# Altium schematic sheet CAM_LCD_TV.SchDoc
size 558 x 431 mm
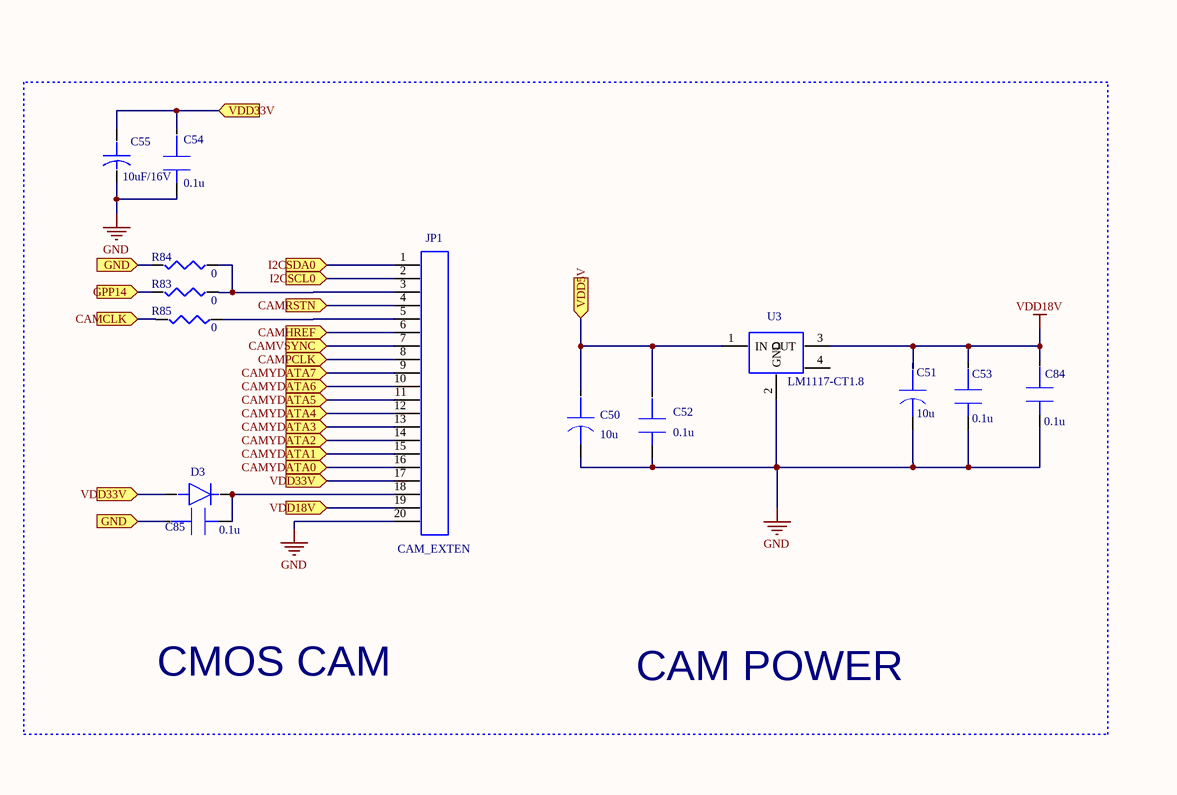
[diagram p0: CAM_LCD_TV.SchDoc, top left]
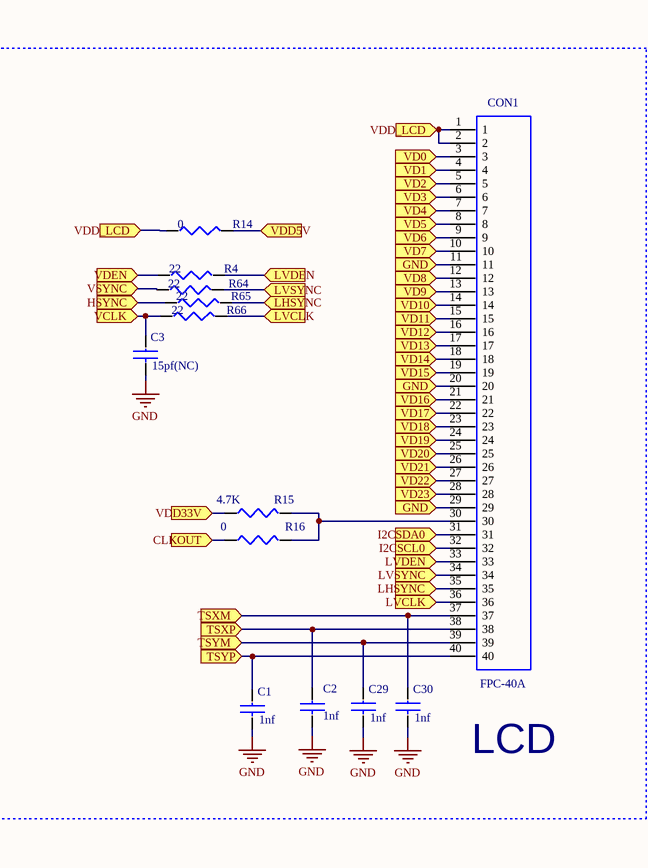
[diagram p1: CAM_LCD_TV.SchDoc, top right]
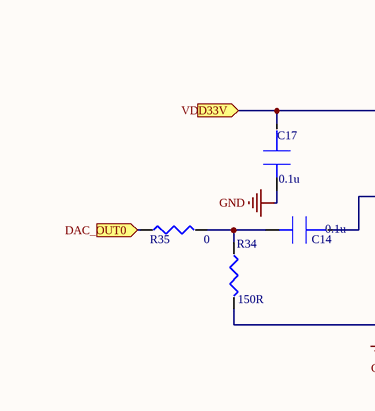
[diagram p2: CAM_LCD_TV.SchDoc, bottom left]
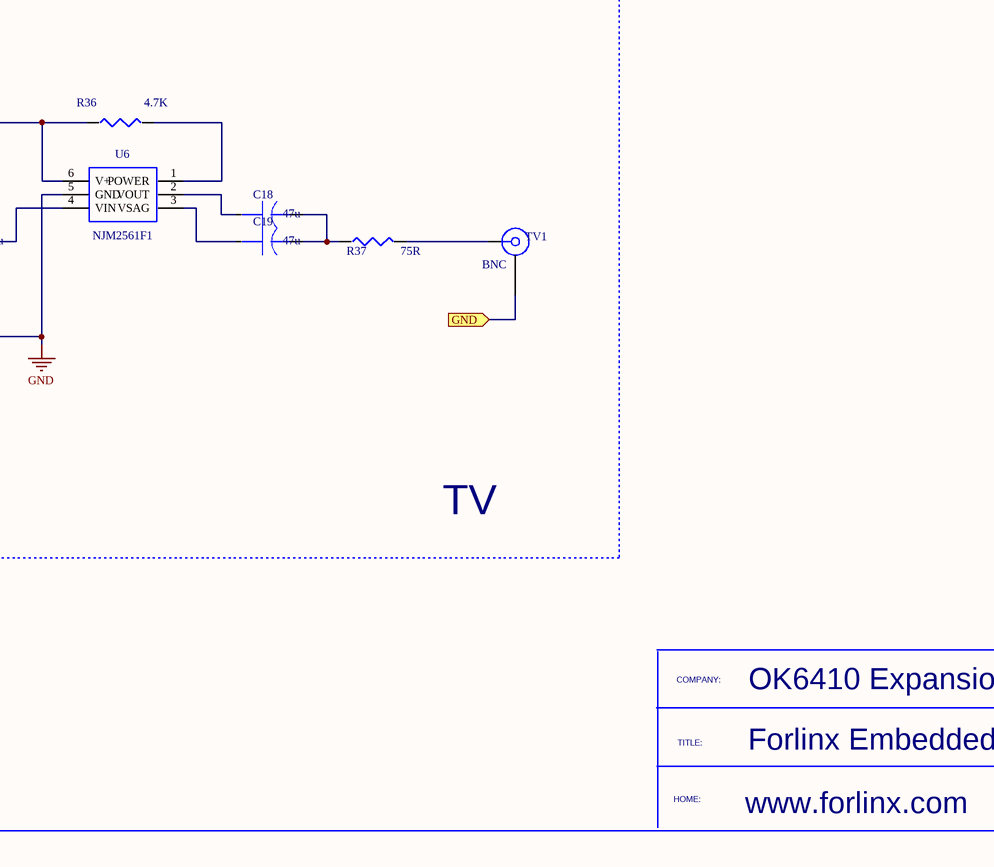
[diagram p3: CAM_LCD_TV.SchDoc, bottom right]

## Parts
C1  value 1nf  (hidden comment: CAP_NP_0)
C2  value 1nf  (hidden comment: CAP_NP_0)
C3  value 15pf(NC)  (hidden comment: CAP_NP_0)
C14  value 0.1u  (hidden comment: CAP1206)
C17  value 0.1u  (hidden comment: CAP1206)
C18  value 47u  (hidden comment: CAP-AE4)
C19  value 47u  (hidden comment: CAP-AE4)
C29  value 1nf  (hidden comment: CAP_NP_0)
C30  value 1nf  (hidden comment: CAP_NP_0)
C50  value 10u  (hidden comment: CAP-AE4)
C51  value 10u  (hidden comment: CAP-AE4)
C52  value 0.1u  (hidden comment: CAP1206)
C53  value 0.1u  (hidden comment: CAP1206)
C54  value 0.1u  (hidden comment: CAP1206)
C55  value 10uF/16V  (hidden comment: CAPACITOR_POL_0B)
C84  value 0.1u  (hidden comment: CAP1206)
C85  value 0.1u  (hidden comment: CAP1206)
CON1  FPC-40A
D3  DIODE  (value not drawn)
JP1  CAM_EXTEN
R4  value 22  (hidden comment: RESISTOR_2)
R14  value 0  (hidden comment: RESISTOR_2)
R15  value 4.7K  (hidden comment: RESISTOR_2)
R16  value 0  (hidden comment: RESISTOR_2)
R34  value 150R  (hidden comment: R)
R35  value 0  (hidden comment: R)
R36  value 4.7K  (hidden comment: R)
R37  value 75R  (hidden comment: R)
R64  value 22  (hidden comment: RESISTOR_2)
R65  value 22  (hidden comment: RESISTOR_2)
R66  value 22  (hidden comment: RESISTOR_2)
R83  value 0  (hidden comment: R_0)
R84  value 0  (hidden comment: R_0)
R85  value 0  (hidden comment: R_0)
TV1  value BNC  (hidden comment: BNC_1)
U3  LM1117-CT1.8
U6  NJM2561F1

## Blocks framed on the sheet
LCD: C1-C3 C29 C30 CON1 R4 R14-R16 R64-R66
TV: C14 C17-C19 R34-R37 TV1 U6

## Ports
CAMCLK, CAMHREF, CAMPCLK, CAMRSTN, CAMVSYNC, CAMYDATA0, CAMYDATA1, CAMYDATA2, CAMYDATA3, CAMYDATA4, CAMYDATA5, CAMYDATA6, CAMYDATA7, CLKOUT, DAC_OUT0, GND, GPP14, HSYNC, I2CSCL0, I2CSDA0, LHSYNC, LVCLK, LVDEN, LVSYNC, TSXM, TSXP, TSYM, TSYP, VCLK, VD0, VD1, VD2, VD3, VD4, VD5, VD6, VD7, VD8, VD9, VD10, VD11, VD12, VD13, VD14, VD15, VD16, VD17, VD18, VD19, VD20, VD21, VD22, VD23, VDD5V, VDD18V, VDD33V, VDD_LCD, VDEN, VSYNC

## Nets
GND: C1.2 C2.2 C3.2 C17.2 C29.2 C30.2 C50.2 C51.2 C52.2 C53.2 C54.2 C55.2 C84.2 JP1.20 R34.2 U3.2(GND) U6.5(GND)
VDD18V: C51.1 C53.1 C84.1 U3.3(OUT)
CAMCLK: R85.2 ; port CAMCLK
CAMHREF: JP1.6 ; port CAMHREF
CAMPCLK: JP1.8 ; port CAMPCLK
CAMRSTN: JP1.4 ; port CAMRSTN
CAMVSYNC: JP1.7 ; port CAMVSYNC
CAMYDATA0: JP1.16 ; port CAMYDATA0
CAMYDATA1: JP1.15 ; port CAMYDATA1
CAMYDATA2: JP1.14 ; port CAMYDATA2
CAMYDATA3: JP1.13 ; port CAMYDATA3
CAMYDATA4: JP1.12 ; port CAMYDATA4
CAMYDATA5: JP1.11 ; port CAMYDATA5
CAMYDATA6: JP1.10 ; port CAMYDATA6
CAMYDATA7: JP1.9 ; port CAMYDATA7
CLKOUT: R16.2 ; port CLKOUT
DAC_OUT0: R35.1 ; port DAC_OUT0
GND: C85.1 CON1.11 CON1.20 CON1.29 R84.2 TV1.2(SHIELD) ; port GND  [a separate net that carries the same name]
GPP14: R83.2 ; port GPP14
HSYNC: R65.1 ; port HSYNC
I2CSCL0: CON1.32 JP1.2 ; port I2CSCL0
I2CSDA0: CON1.31 JP1.1 ; port I2CSDA0
LHSYNC: CON1.35 R65.2 ; port LHSYNC
LVCLK: CON1.36 R66.2 ; port LVCLK
LVDEN: CON1.33 R4.2 ; port LVDEN
LVSYNC: CON1.34 R64.2 ; port LVSYNC
TSXM: C30.1 CON1.37 ; port TSXM
TSXP: C2.1 CON1.38 ; port TSXP
TSYM: C29.1 CON1.39 ; port TSYM
TSYP: C1.1 CON1.40 ; port TSYP
VCLK: C3.1 R66.1 ; port VCLK
VD0: CON1.3 ; port VD0
VD1: CON1.4 ; port VD1
VD2: CON1.5 ; port VD2
VD3: CON1.6 ; port VD3
VD4: CON1.7 ; port VD4
VD5: CON1.8 ; port VD5
VD6: CON1.9 ; port VD6
VD7: CON1.10 ; port VD7
VD8: CON1.12 ; port VD8
VD9: CON1.13 ; port VD9
VD10: CON1.14 ; port VD10
VD11: CON1.15 ; port VD11
VD12: CON1.16 ; port VD12
VD13: CON1.17 ; port VD13
VD14: CON1.18 ; port VD14
VD15: CON1.19 ; port VD15
VD16: CON1.21 ; port VD16
VD17: CON1.22 ; port VD17
VD18: CON1.23 ; port VD18
VD19: CON1.24 ; port VD19
VD20: CON1.25 ; port VD20
VD21: CON1.26 ; port VD21
VD22: CON1.27 ; port VD22
VD23: CON1.28 ; port VD23
VDD5V: C50.1 C52.1 R14.2 U3.1(IN) ; port VDD5V
VDD18V: JP1.19 ; port VDD18V  [a separate net that carries the same name]
VDD33V: C17.1 C54.1 C55.1 D3.2(A) JP1.17 R15.2 R36.1 U6.6(V+) ; port VDD33V
VDD_LCD: CON1.1 CON1.2 R14.1 ; port VDD_LCD
VDEN: R4.1 ; port VDEN
VSYNC: R64.1 ; port VSYNC
NetC14_1: C14.1 U6.4(VIN)
NetC14_2: C14.2 R34.1 R35.2
NetC18_1: C18.1 U6.2(VOUT)
NetC18_2: C18.2 C19.2 R37.1
NetC19_1: C19.1 U6.3(VSAG)
NetC85_2: C85.2 D3.1(K) JP1.18
NetCON1_30: CON1.30 R15.1 R16.1
NetJP1_3: JP1.3 R83.1 R84.1
NetJP1_5: JP1.5 R85.1
NetR36_2: R36.2 U6.1(POWER)
NetR37_2: R37.2 TV1.1(CENTER)

Not connected (* = marked no-connect by the designer): U3 4

## Notes on the sheet
- CMOS CAM
- CAM POWER
- COMPANY:
- OK6410 Expansion Board
- TITLE:
- Forlinx Embedded
- HOME:
- www.forlinx.com

## Library data of the parts
C1-C3 C29 C30 = CAP_NP_0: PCB Footprint: C2012; PCB DECAL: 0603A
C14 C17 C52-C54 C84 C85 = CAP1206: SURFACE MOUNT CAPACITOR 0.062 X 0.126 INCHES; Manufacturer #1: IPC SM-782 STD.; PCB DECAL: 0603A
C18 C19 C50 C51 = CAP-AE4: ALUMINUM ELECTROLYTIC CAP.; Manufacturer #1: IPC SM-782 STD.; PCB DECAL: 3216A
C55 = CAPACITOR_POL_0B: PCB Footprint: C3216; PCB DECAL: 3216A
CON1 = FPC-40A: PCB DECAL: FPC40
D3 = DIODE: GENERIC DIODE W ALTERNATE; Sim.Analog.Model: d1n914; Sim.Analog.Order: Model$; Sim.Analog.Prefix: D; PCB DECAL: LED1206N
JP1 = CAM_EXTEN: PCB DECAL: IDC20S
R4 R14-R16 R64-R66 = RESISTOR_2: PCB Footprint: C2012; PCB DECAL: 0603A
R34-R37 = R: PCB DECAL: 0603A
R83-R85 = R_0: PCB Footprint: C2012; PCB DECAL: 0603A
TV1 = BNC_1: PCB Footprint: con_av; PCB DECAL: TVB
U3 = LM1117-CT1.8: PCB DECAL: TO-252L
U6 = NJM2561F1: PCB DECAL: MTP6